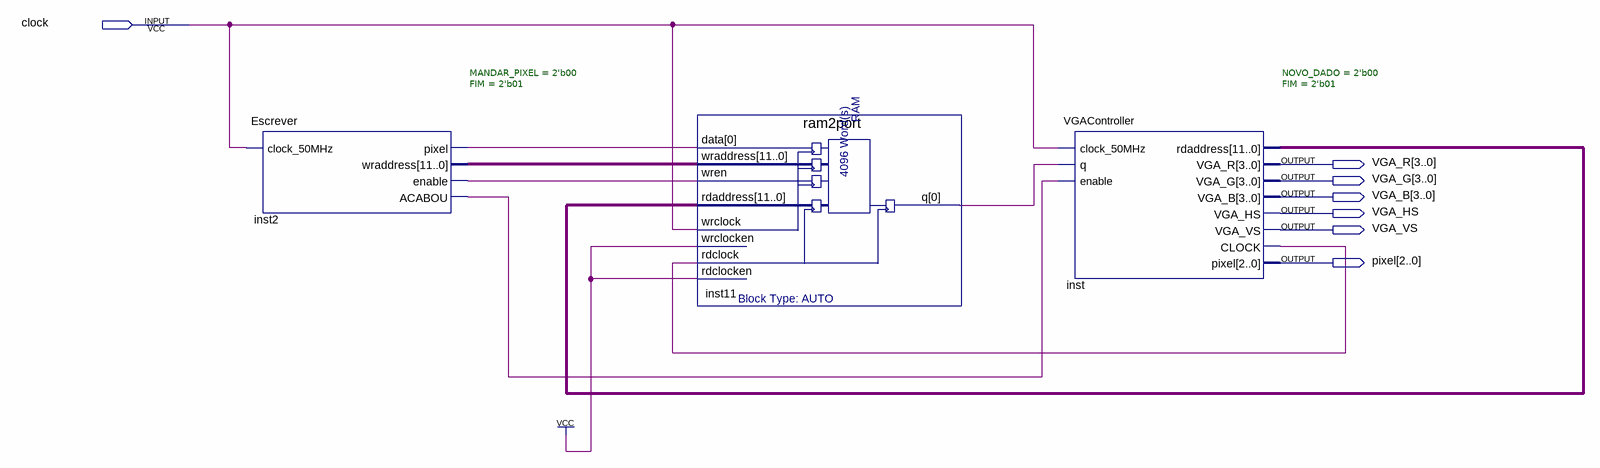
[diagram p0: schematic sheet]
// Quartus schematic Teste_Escrita.bdf as structural Verilog: 3 symbols, 7 pins
module Teste_Escrita (
  input  clock,
  output [3:0] VGA_R,
  output [3:0] VGA_G,
  output [3:0] VGA_B,
  output VGA_HS,
  output VGA_VS,
  output [2:0] pixel
);

  wire inst2_acabou, inst2_enable, inst2_pixel, inst11_q, inst_clock;
  wire [11:0] inst2_wraddress, inst_rdaddress;

  Escrever #(.MANDAR_PIXEL(2'b00), .FIM(2'b01)) inst2 (
    .clock_50MHz(clock), .pixel(inst2_pixel), .wraddress(inst2_wraddress), .enable(inst2_enable),
    .ACABOU(inst2_acabou));
  ram2port inst11 (
    .data(inst2_pixel), .wraddress(inst2_wraddress), .wren(inst2_enable), .rdaddress(inst_rdaddress),
    .wrclock(clock), .wrclocken(1'b1), .rdclock(inst_clock), .rdclocken(1'b1), .q(inst11_q));
  VGAController #(.NOVO_DADO(2'b00), .FIM(2'b01)) inst (
    .clock_50MHz(clock), .q(inst11_q), .enable(inst2_acabou), .rdaddress(inst_rdaddress), .VGA_R(VGA_R),
    .VGA_G(VGA_G), .VGA_B(VGA_B), .VGA_HS(VGA_HS), .VGA_VS(VGA_VS), .CLOCK(inst_clock), .pixel(pixel));
endmodule
